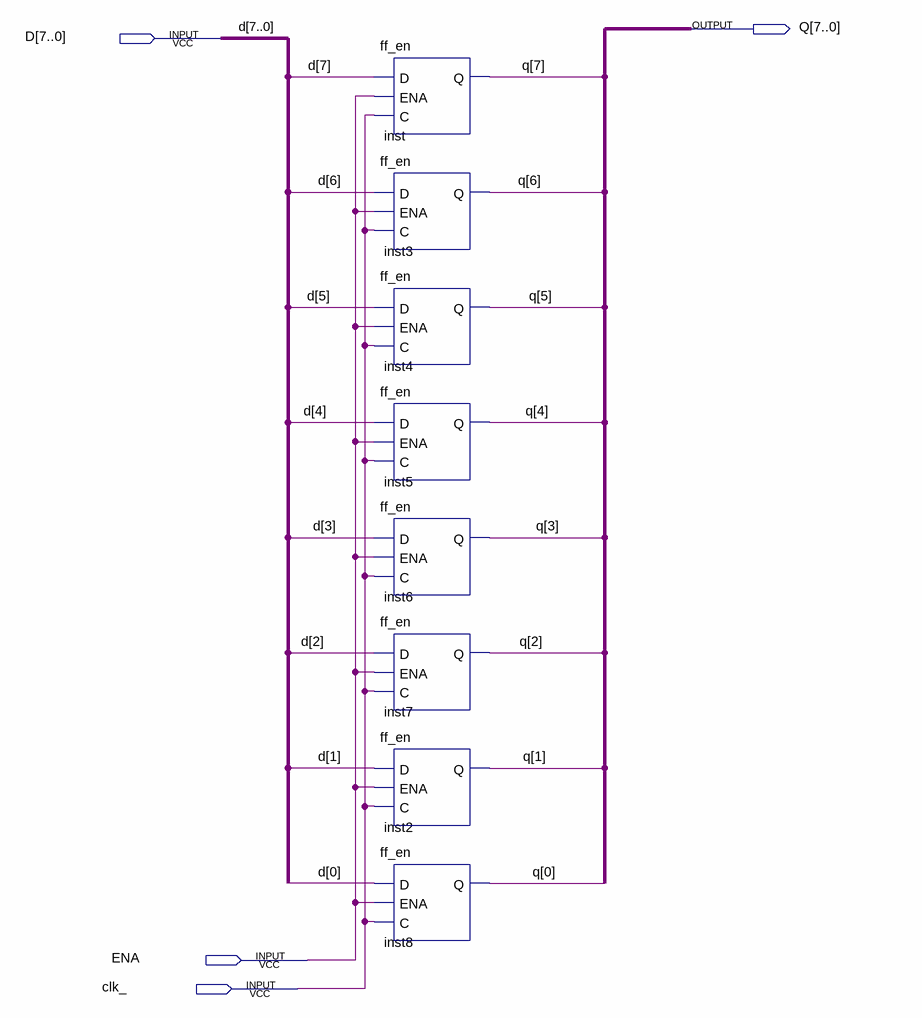
[diagram p0: schematic sheet]
// Quartus schematic ff8.bdf as structural Verilog: 8 symbols, 4 pins
module ff8 (
  input  [7:0] D,
  input  ENA,
  input  clk_,
  output [7:0] Q
);

  ff_en inst (.D(D[7]), .ENA(ENA), .C(clk_), .Q(Q[7]));
  ff_en inst3 (.D(D[6]), .ENA(ENA), .C(clk_), .Q(Q[6]));
  ff_en inst4 (.D(D[5]), .ENA(ENA), .C(clk_), .Q(Q[5]));
  ff_en inst5 (.D(D[4]), .ENA(ENA), .C(clk_), .Q(Q[4]));
  ff_en inst6 (.D(D[3]), .ENA(ENA), .C(clk_), .Q(Q[3]));
  ff_en inst7 (.D(D[2]), .ENA(ENA), .C(clk_), .Q(Q[2]));
  ff_en inst2 (.D(D[1]), .ENA(ENA), .C(clk_), .Q(Q[1]));
  ff_en inst8 (.D(D[0]), .ENA(ENA), .C(clk_), .Q(Q[0]));
endmodule
